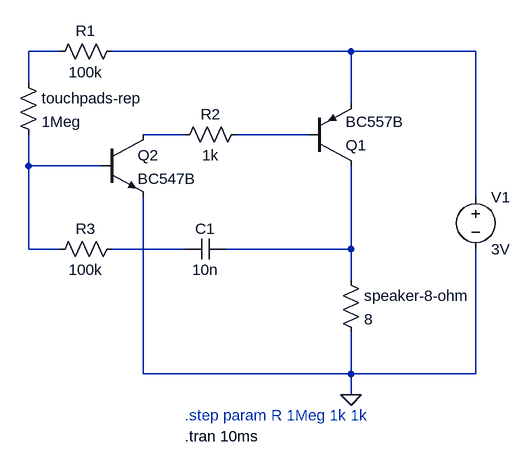
[diagram p0: schematic lie-detector-1Meg-ohm-resistance.asc]
lie-detector-1Meg-ohm-resistance.asc, the LTspice schematic file:
Version 4
SHEET 1 880 768
WIRE 128 160 80 160
WIRE 576 160 208 160
WIRE 768 160 576 160
WIRE 80 208 80 160
WIRE 576 240 576 160
WIRE 320 288 256 288
WIRE 512 288 400 288
WIRE 80 336 80 288
WIRE 192 336 80 336
WIRE 768 384 768 160
WIRE 80 464 80 336
WIRE 128 464 80 464
WIRE 320 464 208 464
WIRE 576 464 576 336
WIRE 576 464 384 464
WIRE 576 512 576 464
WIRE 256 656 256 384
WIRE 576 656 576 592
WIRE 576 656 256 656
WIRE 768 656 768 464
WIRE 768 656 576 656
WIRE 576 688 576 656
FLAG 576 688 0
SYMBOL res 224 144 R90
WINDOW 0 0 56 VBottom 2
WINDOW 3 32 56 VTop 2
SYMATTR InstName R1
SYMATTR Value 100k
SYMBOL res 416 272 R90
WINDOW 0 0 56 VBottom 2
WINDOW 3 32 56 VTop 2
SYMATTR InstName R2
SYMATTR Value 1k
SYMBOL res 224 448 R90
WINDOW 0 0 56 VBottom 2
WINDOW 3 32 56 VTop 2
SYMATTR InstName R3
SYMATTR Value 100k
SYMBOL cap 384 448 R90
WINDOW 0 0 32 VBottom 2
WINDOW 3 32 32 VTop 2
SYMATTR InstName C1
SYMATTR Value 10n
SYMBOL npn 192 288 R0
SYMATTR InstName Q2
SYMATTR Value BC547B
SYMBOL pnp 512 336 M180
SYMATTR InstName Q1
SYMATTR Value BC557B
SYMBOL voltage 768 368 R0
SYMATTR InstName V1
SYMATTR Value 3V
SYMBOL res 560 496 R0
SYMATTR InstName speaker-8-ohm
SYMATTR Value 8
SYMBOL res 64 192 R0
SYMATTR InstName touchpads-rep
SYMATTR Value 1Meg
TEXT 320 752 Left 2 !.tran 10ms
TEXT 320 720 Left 2 ;.step param R 1Meg 1k 1k

The netlist it stands for:
* lie-detector-1Meg-ohm-resistance.asc
R1 N002 N001 100k
R2 N004 N003 1k
R3 N006 N005 100k
C1 N007 N006 10n
Q2 N003 N005 0 0 BC547B
Q1 N007 N004 N002 0 BC557B
V1 N002 0 3V
R§speaker-8-ohm N007 0 8
R§touchpads-rep N001 N005 1Meg
.model NPN NPN
.model PNP PNP
.lib standard.bjt
.tran 10ms
* .step param R 1Meg 1k 1k
.backanno
.end